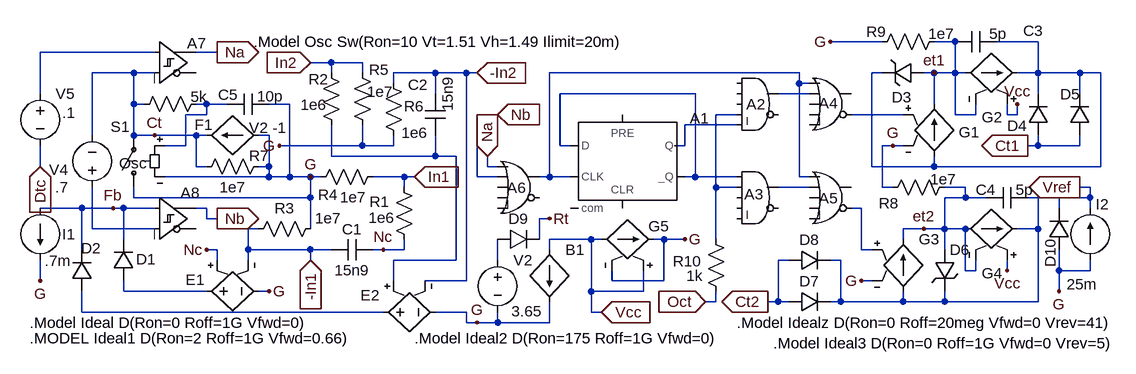
[diagram p0: schematic TL494_Jer.asc]
TL494_Jer.asc, the LTspice schematic file:
Version 4
SHEET 1 1700 820
WIRE 256 96 176 96
WIRE 368 96 336 96
WIRE 496 96 432 96
WIRE -864 112 -1040 112
WIRE -768 112 -800 112
WIRE -592 128 -624 128
WIRE -544 128 -592 128
WIRE -896 144 -960 144
WIRE -864 144 -896 144
WIRE -592 144 -592 128
WIRE -544 144 -544 128
WIRE -432 144 -496 144
WIRE -384 144 -432 144
WIRE -368 144 -384 144
WIRE 128 144 -256 144
WIRE 256 144 240 144
WIRE 336 144 320 144
WIRE 368 144 368 96
WIRE 368 144 336 144
WIRE 384 144 368 144
WIRE 496 144 496 96
WIRE 496 144 464 144
WIRE 560 144 496 144
WIRE 592 144 560 144
WIRE -496 160 -496 144
WIRE 128 160 128 144
WIRE 144 160 128 160
WIRE -1040 176 -1040 112
WIRE -432 176 -432 144
WIRE -32 176 -240 176
WIRE 144 176 96 176
WIRE 496 176 496 144
WIRE 560 176 560 144
WIRE -896 192 -896 144
WIRE -880 192 -896 192
WIRE -784 192 -800 192
WIRE -752 192 -784 192
WIRE -656 192 -688 192
WIRE 336 192 336 144
WIRE -784 208 -784 192
WIRE -784 208 -816 208
WIRE -336 208 -368 208
WIRE 32 208 0 208
WIRE 288 208 208 208
WIRE 368 208 368 144
WIRE 400 208 400 192
WIRE 400 208 368 208
WIRE 448 208 448 192
WIRE 464 208 464 192
WIRE 464 208 448 208
WIRE 32 224 -48 224
WIRE -960 240 -960 144
WIRE -896 240 -896 192
WIRE -864 240 -896 240
WIRE -800 240 -864 240
WIRE -784 240 -800 240
WIRE -688 240 -704 240
WIRE -816 256 -816 208
WIRE -816 256 -848 256
WIRE -544 256 -544 224
WIRE -544 256 -672 256
WIRE -496 256 -496 240
WIRE -496 256 -544 256
WIRE -240 256 -240 176
WIRE -224 256 -240 256
WIRE -48 256 -48 224
WIRE -48 256 -64 256
WIRE 272 256 256 256
WIRE 288 256 272 256
WIRE 496 256 496 240
WIRE 496 256 480 256
WIRE 560 256 560 240
WIRE 560 256 496 256
WIRE -592 272 -592 224
WIRE -432 272 -432 240
WIRE -432 272 -592 272
WIRE -400 272 -432 272
WIRE -1040 288 -1040 256
WIRE -800 288 -800 240
WIRE -784 288 -800 288
WIRE -688 288 -688 240
WIRE -688 288 -704 288
WIRE -352 288 -352 272
WIRE -336 288 -352 288
WIRE 240 288 240 144
WIRE 336 288 336 272
WIRE 336 288 240 288
WIRE 592 288 592 144
WIRE 592 288 336 288
WIRE -688 304 -688 288
WIRE -688 304 -848 304
WIRE -656 304 -656 192
WIRE -656 304 -688 304
WIRE -624 304 -656 304
WIRE -608 304 -624 304
WIRE -480 304 -528 304
WIRE -464 304 -480 304
WIRE -368 304 -368 208
WIRE -336 304 -368 304
WIRE -256 304 -256 144
WIRE -256 304 -272 304
WIRE -224 304 -256 304
WIRE -32 304 -32 176
WIRE -32 304 -48 304
WIRE 32 304 -32 304
WIRE 128 304 128 160
WIRE 144 304 128 304
WIRE -480 320 -480 304
WIRE 0 320 0 208
WIRE 32 320 0 320
WIRE 144 320 96 320
WIRE 256 320 256 256
WIRE 272 320 256 320
WIRE 384 320 352 320
WIRE 576 320 560 320
WIRE -896 336 -896 320
WIRE -624 336 -624 304
WIRE -624 336 -896 336
WIRE 384 336 384 320
WIRE 384 336 352 336
WIRE 416 336 384 336
WIRE 496 336 480 336
WIRE 576 336 576 320
WIRE 576 336 528 336
WIRE -976 352 -1040 352
WIRE -928 352 -976 352
WIRE -912 352 -928 352
WIRE -864 352 -912 352
WIRE -784 352 -800 352
WIRE 224 352 208 352
WIRE 528 352 528 336
WIRE 576 352 576 336
WIRE -784 368 -784 352
WIRE -768 368 -784 368
WIRE -256 368 -272 368
WIRE -960 384 -960 320
WIRE -864 384 -960 384
WIRE -704 384 -720 384
WIRE -624 384 -624 336
WIRE 320 384 288 384
WIRE 352 384 352 336
WIRE 352 384 320 384
WIRE 384 384 352 384
WIRE 496 384 496 336
WIRE 496 384 464 384
WIRE -912 400 -912 352
WIRE -272 400 -272 368
WIRE -192 400 -256 400
WIRE -176 400 -192 400
WIRE -80 400 -96 400
WIRE -48 400 -80 400
WIRE 0 400 0 320
WIRE 288 400 288 384
WIRE -976 416 -976 352
WIRE -768 416 -784 416
WIRE -720 416 -720 384
WIRE -624 416 -720 416
WIRE -592 416 -624 416
WIRE -512 416 -528 416
WIRE -480 416 -480 400
WIRE -480 416 -512 416
WIRE -256 416 -256 400
WIRE 224 416 224 352
WIRE 240 416 224 416
WIRE 352 416 352 384
WIRE -768 432 -768 416
WIRE -720 432 -720 416
WIRE -624 432 -624 416
WIRE -400 432 -400 272
WIRE -400 432 -496 432
WIRE -336 432 -336 400
WIRE 112 432 96 432
WIRE 192 432 176 432
WIRE 384 448 384 384
WIRE 400 448 400 432
WIRE 400 448 384 448
WIRE 448 448 448 432
WIRE 528 448 528 416
WIRE 576 448 576 432
WIRE 576 448 528 448
WIRE -1040 464 -1040 432
WIRE -496 464 -496 432
WIRE -384 464 -384 144
WIRE -384 464 -448 464
WIRE -160 464 -160 448
WIRE -80 464 -80 400
WIRE -80 464 -160 464
WIRE 240 464 224 464
WIRE -912 480 -912 464
WIRE -784 480 -912 480
WIRE -688 480 -704 480
WIRE -192 480 -192 400
WIRE -112 480 -112 448
WIRE -112 480 -192 480
WIRE 528 480 528 448
WIRE 0 496 0 480
WIRE 0 496 -16 496
WIRE 96 496 96 432
WIRE 96 496 80 496
WIRE 112 496 96 496
WIRE 192 496 192 432
WIRE 192 496 176 496
WIRE 288 496 288 480
WIRE 288 496 192 496
WIRE 352 496 352 480
WIRE 352 496 288 496
WIRE 496 496 496 384
WIRE 496 496 352 496
WIRE -976 512 -976 480
WIRE -512 512 -976 512
WIRE -384 512 -432 512
WIRE -192 512 -192 480
WIRE -176 512 -192 512
WIRE -384 528 -384 512
WIRE -368 528 -384 528
WIRE -336 528 -336 512
WIRE -336 528 -368 528
WIRE -256 528 -256 496
WIRE -256 528 -336 528
FLAG 336 144 et1
FLAG 320 384 et2
FLAG -352 272 Na
IOPIN -352 272 In
FLAG -336 208 Nb
IOPIN -336 208 In
FLAG -768 112 Na
IOPIN -768 112 Out
FLAG -768 368 Nb
IOPIN -768 368 Out
FLAG -464 304 In1
IOPIN -464 304 In
FLAG -512 416 Nc
FLAG -624 128 In2
IOPIN -624 128 In
FLAG -624 432 -In1
IOPIN -624 432 In
FLAG -784 416 Nc
FLAG 480 256 Ct1
IOPIN 480 256 Out
FLAG 448 448 Vcc
FLAG 80 496 Ct2
IOPIN 80 496 Out
FLAG -256 368 Rt
FLAG -176 512 Vcc
IOPIN -176 512 In
FLAG 560 320 Vref
IOPIN 560 320 Out
FLAG -16 496 Oct
IOPIN -16 496 In
FLAG -1040 288 Dtc
IOPIN -1040 288 In
FLAG -1040 464 G
FLAG -624 304 G
FLAG -688 480 G
FLAG 176 96 G
FLAG 224 464 G
FLAG -48 400 G
FLAG -368 528 G
FLAG -672 256 G
FLAG 272 256 G
FLAG 464 192 Vcc
FLAG 528 480 G
FLAG -368 144 -In2
IOPIN -368 144 In
FLAG -864 240 Ct
FLAG -928 352 Fb
SYMBOL Digital\\dflop -144 208 R0
WINDOW 3 -120 -53 Invisible 0
SYMATTR Value Vhigh=5 Trise=50n Rout=30
SYMATTR InstName A1
SYMBOL Digital\\and 64 128 R0
WINDOW 0 -17 64 Left 0
WINDOW 3 -160 -50 Invisible 0
SYMATTR InstName A2
SYMATTR Value Vhigh=5 Trise=50n Rout=30
SYMBOL Digital\\and 64 272 R0
WINDOW 0 -20 59 Left 0
WINDOW 3 -1 8 Invisible 0
SYMATTR InstName A3
SYMATTR Value Vhigh=5 Trise=50n Rout=30
SYMBOL Digital\\or 176 128 R0
WINDOW 0 -18 63 Left 0
WINDOW 3 -75 -28 Invisible 0
SYMATTR InstName A4
SYMATTR Value Vhigh=5 Trise=300n Rout=30
SYMBOL Digital\\or 176 272 R0
WINDOW 0 -18 65 Left 0
WINDOW 3 147 38 Invisible 0
SYMATTR InstName A5
SYMATTR Value Vhigh=5 Trise=300n Rout=30
SYMBOL g 336 176 R0
WINDOW 3 24 104 Invisible 0
WINDOW 0 38 59 Left 0
SYMATTR Value table=(1 0,4 250m)
SYMATTR InstName G1
SYMBOL g 288 384 R0
WINDOW 3 24 104 Invisible 0
SYMATTR Value table=(1 0,4 250m)
SYMATTR InstName G3
SYMBOL Digital\\or -304 256 R0
WINDOW 0 -18 65 Left 0
WINDOW 3 147 38 Invisible 0
SYMATTR InstName A6
SYMATTR Value Vhigh=5 Trise=50n Rout=30
SYMBOL Digital\\diffschmitt -864 64 R0
WINDOW 3 8 120 Invisible 0
WINDOW 0 50 34 Left 0
SYMATTR Value Vt=0 Vh=0 Vhigh=5
SYMATTR InstName A7
SYMBOL Digital\\diffschmitt -864 304 R0
WINDOW 3 8 120 Invisible 0
SYMATTR Value Vt=0 Vh=0 Vhigh=5
SYMATTR InstName A8
SYMBOL voltage -960 336 R180
WINDOW 0 37 43 Left 0
WINDOW 3 37 16 Left 0
SYMATTR InstName V4
SYMATTR Value .7
SYMBOL voltage -1040 160 R0
WINDOW 3 34 45 Left 0
SYMATTR Value .1
SYMATTR InstName V5
SYMBOL diode -896 464 R180
WINDOW 0 -34 33 Left 0
WINDOW 3 24 0 Invisible 0
SYMATTR InstName D1
SYMATTR Value Ideal
SYMBOL diode -960 480 R180
WINDOW 0 -14 66 Left 0
WINDOW 3 24 0 Invisible 0
SYMATTR InstName D2
SYMATTR Value Ideal
SYMBOL res -496 304 R0
WINDOW 0 -37 38 Left 0
WINDOW 3 -39 63 Left 0
SYMATTR InstName R1
SYMATTR Value 1e6
SYMBOL res -608 128 R0
WINDOW 0 -19 26 Left 0
WINDOW 3 -31 65 Left 0
SYMATTR InstName R2
SYMATTR Value 1e6
SYMBOL cap -528 400 R90
WINDOW 0 0 32 VBottom 0
WINDOW 3 32 32 VTop 0
SYMATTR InstName C1
SYMATTR Value 15n9
SYMBOL cap -416 240 R180
WINDOW 0 27 78 Left 0
WINDOW 3 -3 37 VRight 0
SYMATTR InstName C2
SYMATTR Value 15n9
SYMBOL zener 320 128 R90
WINDOW 0 69 34 VBottom 0
WINDOW 3 36 32 Invisible 0
SYMATTR InstName D3
SYMATTR Value IdealZ
SYMBOL e -800 480 M90
WINDOW 3 24 104 Invisible 0
WINDOW 0 -18 13 VLeft 0
SYMATTR Value table=(0,0 1.96m,0 2m,2 2.04m,4 20m,4.5)
SYMATTR InstName E1
SYMBOL res -608 368 R90
WINDOW 0 0 56 VBottom 0
WINDOW 3 -16 -11 VTop 0
SYMATTR InstName R3
SYMATTR Value 1e7
SYMBOL res -512 288 R90
WINDOW 0 59 85 VBottom 0
WINDOW 3 32 46 VTop 0
SYMATTR InstName R4
SYMATTR Value 1e7
SYMBOL res -560 128 R0
WINDOW 0 26 11 Left 0
WINDOW 3 23 45 Left 0
SYMATTR InstName R5
SYMATTR Value 1e7
SYMBOL res -512 144 R0
WINDOW 0 32 51 Left 0
WINDOW 3 28 92 Left 0
SYMATTR InstName R6
SYMATTR Value 1e6
SYMBOL current -1040 352 R0
WINDOW 0 34 40 Left 0
WINDOW 3 7 81 Left 0
SYMATTR InstName I1
SYMATTR Value .7m
SYMBOL voltage -336 416 R0
WINDOW 3 21 95 Left 0
SYMATTR Value 3.65
SYMATTR InstName V2
SYMBOL f -704 240 R90
WINDOW 0 -1 84 VBottom 0
WINDOW 3 -27 -14 VTop 0
SYMATTR InstName F1
SYMATTR Value V2 -1
SYMBOL sw -896 336 R180
WINDOW 0 6 109 Left 0
WINDOW 3 -20 53 Left 0
SYMATTR InstName S1
SYMATTR Value Osc
SYMBOL diode 512 240 R180
WINDOW 0 33 15 Left 0
WINDOW 3 24 0 Invisible 0
SYMATTR InstName D4
SYMATTR Value Ideal1
SYMBOL diode 576 240 R180
WINDOW 0 15 63 Left 0
WINDOW 3 24 0 Invisible 0
SYMATTR InstName D5
SYMATTR Value Ideal2
SYMBOL g 480 144 M270
WINDOW 3 24 104 Invisible 0
WINDOW 0 -68 71 VLeft 0
SYMATTR Value table=(0 250m,1.42 243m,1.46 150m,1.57 0)
SYMATTR InstName G2
SYMBOL zener 336 416 R0
WINDOW 3 24 72 Invisible 0
SYMATTR Value IdealZ
SYMATTR InstName D6
SYMBOL diode 112 512 R270
WINDOW 0 32 32 VTop 0
WINDOW 3 0 32 Invisible 0
SYMATTR InstName D7
SYMATTR Value Ideal1
SYMBOL diode 112 448 R270
WINDOW 0 32 32 VTop 0
WINDOW 3 0 32 Invisible 0
SYMATTR InstName D8
SYMATTR Value Ideal2
SYMBOL g 480 384 M270
WINDOW 3 24 104 Invisible 0
WINDOW 0 -68 71 VLeft 0
SYMATTR Value table=(0 250m,1.42 243m,1.46 150m,1.57 0)
SYMATTR InstName G4
SYMBOL cap 432 80 R90
WINDOW 0 15 -56 VBottom 0
WINDOW 3 -12 -2 VTop 0
SYMATTR InstName C3
SYMATTR Value 5p
SYMBOL cap 480 320 R90
WINDOW 0 19 65 VBottom 0
WINDOW 3 -12 5 VTop 0
SYMATTR InstName C4
SYMATTR Value 5p
SYMBOL diode -336 384 M90
WINDOW 3 32 32 Invisible 0
WINDOW 0 0 32 VBottom 0
SYMATTR Value Ideal
SYMATTR InstName D9
SYMBOL res -688 272 R90
WINDOW 0 15 15 VBottom 0
WINDOW 3 32 56 VTop 0
SYMATTR InstName R7
SYMATTR Value 1e7
SYMBOL res 368 304 R90
WINDOW 0 56 102 VBottom 0
WINDOW 3 -12 18 VTop 0
SYMATTR InstName R8
SYMATTR Value 1e7
SYMBOL res 352 80 R90
WINDOW 0 16 105 VBottom 0
WINDOW 3 -12 5 VTop 0
SYMATTR InstName R9
SYMATTR Value 1e7
SYMBOL g -80 400 M270
WINDOW 3 24 104 Invisible 0
WINDOW 0 20 24 VLeft 0
SYMATTR Value TABLE=(1 0,5 4.5m,6.85 7.6m,40 8.4m)
SYMATTR InstName G5
SYMBOL current 576 432 R180
WINDOW 0 -29 86 Left 0
WINDOW 3 -11 -37 Left 0
SYMATTR InstName I2
SYMATTR Value 25m
SYMBOL diode 544 416 R180
WINDOW 0 29 -27 VRight 0
WINDOW 3 24 0 Invisible 0
SYMATTR InstName D10
SYMATTR Value Ideal3
SYMBOL bi -256 416 R0
WINDOW 3 24 88 Invisible 0
SYMATTR Value I=I(D10)+25m
SYMATTR InstName B1
SYMBOL res 16 496 R180
WINDOW 0 38 62 Left 0
WINDOW 3 36 40 Left 0
SYMATTR InstName R10
SYMATTR Value 1k
SYMBOL res -784 176 R90
WINDOW 0 17 113 Invisible 0
WINDOW 3 -11 12 VTop 0
SYMATTR InstName R11
SYMATTR Value 5k
SYMBOL cap -688 176 R90
WINDOW 0 17 63 VBottom 0
WINDOW 3 -12 -2 VTop 0
SYMATTR InstName C5
SYMATTR Value 10p
SYMBOL e -528 512 M90
WINDOW 3 24 104 Invisible 0
WINDOW 0 -26 10 VLeft 0
SYMATTR Value table=(0,0 1.96m,0 2m,2 2.04m,4 20m,4.5)
SYMATTR InstName E2
TEXT 32 528 Left 0 !.Model Idealz D(Ron=0 Roff=20meg Vfwd=0 Vrev=41)
TEXT -1056 528 Left 0 !.Model Ideal D(Ron=0 Roff=1G Vfwd=0)
TEXT -712 96 Left 0 !.Model Osc Sw(Ron=10 Vt=1.51 Vh=1.49 Ilimit=20m)
TEXT -1056 552 Left 0 !.MODEL Ideal1 D(Ron=2 Roff=1G Vfwd=0.66)
TEXT -464 552 Left 0 !.Model Ideal2 D(Ron=175 Roff=1G Vfwd=0)
TEXT 88 560 Left 0 !.Model Ideal3 D(Ron=0 Roff=1G Vfwd=0 Vrev=5)

The netlist it stands for:
* TL494_Jer.asc
A1 N004 0 N003 0 0 N004 N009 0 DFLOP Vhigh=5 Trise=50n Rout=30
A2 0 0 0 N007 N009 0 N005 0 AND Vhigh=5 Trise=50n Rout=30
A3 N004 N007 0 0 0 0 N011 0 AND Vhigh=5 Trise=50n Rout=30
A4 N003 N005 0 0 0 N008 0 0 OR Vhigh=5 Trise=300n Rout=30
A5 N003 N011 0 0 0 N013 0 0 OR Vhigh=5 Trise=300n Rout=30
G1 N001 et1 N008 G table=(1 0,4 250m)
G3 N012 et2 N013 G table=(1 0,4 250m)
A6 Na Nb 0 0 0 0 N003 0 OR Vhigh=5 Trise=50n Rout=30
A7 N002 Ct 0 0 0 0 Na 0 SCHMITT Vt=0 Vh=0 Vhigh=5
A8 Fb N014 0 0 0 0 Nb 0 SCHMITT Vt=0 Vh=0 Vhigh=5
V4 N014 Ct .7
V5 N002 Dtc .1
D1 N016 Fb Ideal
D2 N017 Fb Ideal
R1 In1 Nc 1e6
R2 In2 N010 1e6
C1 Nc -In1 15n9
C2 N010 -In2 15n9
D3 et1 N001 IdealZ
E1 N016 G Nc -In1 table=(0,0 1.96m,0 2m,2 2.04m,4 20m,4.5)
R3 G -In1 1e7
R4 In1 G 1e7
R5 In2 G 1e7
R6 -In2 G 1e6
I1 Fb G .7m
V2 N015 G 3.65
F1 G Ct V2 -1
S1 G Ct N006 G Osc
D4 Ct1 N001 Ideal1
D5 Ct1 N001 Ideal2
G2 et1 N001 Vcc et1 table=(0 250m,1.42 243m,1.46 150m,1.57 0)
D6 et2 N012 IdealZ
D7 Ct2 N012 Ideal1
D8 Ct2 N012 Ideal2
G4 et2 N012 Vcc et2 table=(0 250m,1.42 243m,1.46 150m,1.57 0)
C3 N001 et1 5p
C4 N012 et2 5p
D9 N015 Rt Ideal
R7 G Ct 1e7
R8 et2 G 1e7
R9 et1 G 1e7
G5 Vcc G Vcc G TABLE=(1 0,5 4.5m,6.85 7.6m,40 8.4m)
I2 G Vref 25m
D10 G Vref Ideal3
B1 Vcc G I=I(D10)+25m
R10 Oct N007 1k
R11 N006 Ct 5k
C5 G N006 10p
E2 N017 G N010 -In2 table=(0,0 1.96m,0 2m,2 2.04m,4 20m,4.5)
.model D D
.lib standard.dio
.Model Idealz D(Ron=0 Roff=20meg Vfwd=0 Vrev=41)
.Model Ideal D(Ron=0 Roff=1G Vfwd=0)
.Model Osc Sw(Ron=10 Vt=1.51 Vh=1.49 Ilimit=20m)
.MODEL Ideal1 D(Ron=2 Roff=1G Vfwd=0.66)
.Model Ideal2 D(Ron=175 Roff=1G Vfwd=0)
.Model Ideal3 D(Ron=0 Roff=1G Vfwd=0 Vrev=5)
.backanno
.end